# EAGLE design potentiometer (EAGLE 7.2.0)
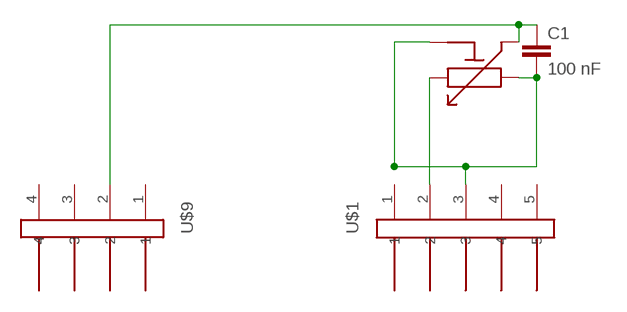
[diagram p0: schematic, sheet 1]

## Parts
C1  100 nF  C-EUC0805  [C0805]
U$1  JUMPER5M  [JUMPER5M]
U$2  POTENTIOMETER-RK09  [POTENTIOMETER-RK09]
U$9  JUMPER4M  [JUMPER4M]

## Nets
GND: C1.2 U$1.3 U$2.1 U$2.GND1(GND) U$2.GND2(GND)
N$1: C1.1 U$2.2 U$9.2
N$2: U$1.2 U$2.3
Unconnected: U$1.1 U$1.4 U$1.5 U$9.1 U$9.3 U$9.4

## Library data of the parts
C1 = resistor:C-EU: CAPACITOR, European symbol
U$1 = !stavebnice03:JUMPER5M
U$2 = !stavebnice03:POTENTIOMETER-RK09
U$9 = !stavebnice03:JUMPER4M

## Board
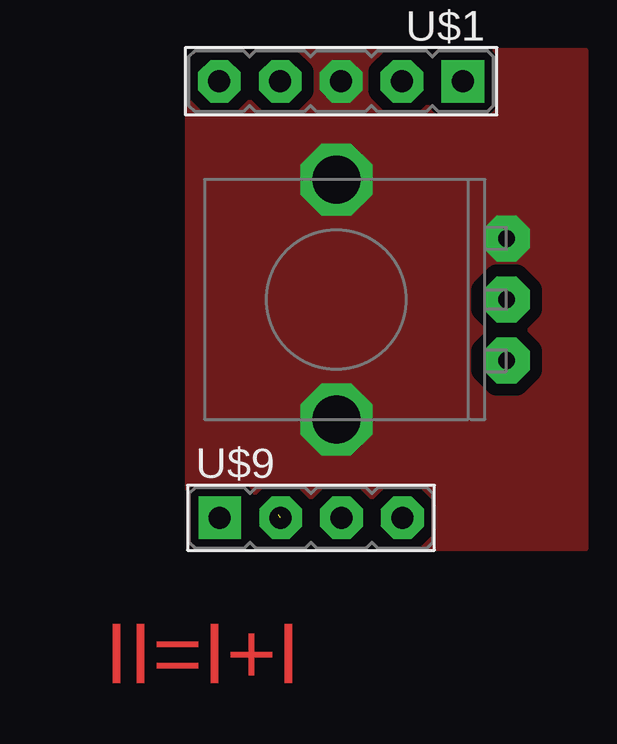
[diagram p1: board, top side]
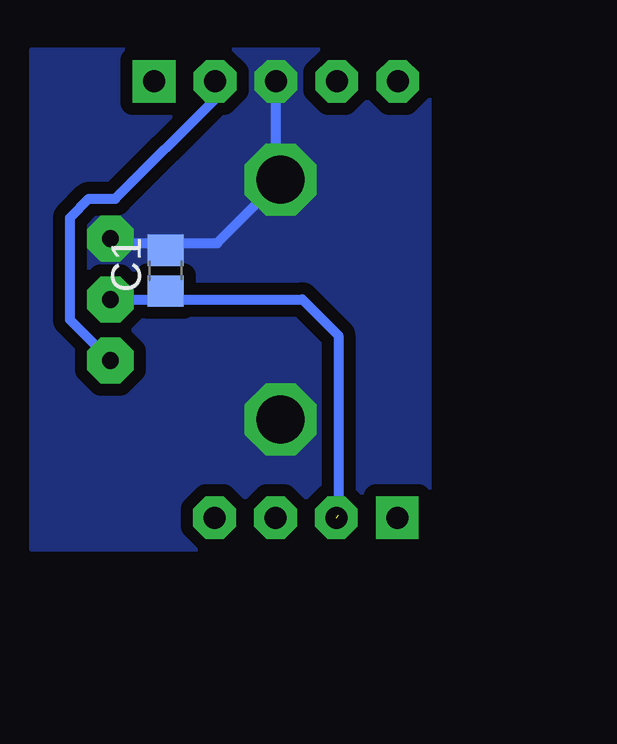
[diagram p2: board, bottom side, seen from below]

No outline drawn. Coordinates in mm, seen from the top.
Copper layers (1*16): Top 0.035mm / dielectric 1.5mm / Bottom 0.035mm
Design rules "default": minimum track width 10mil, minimum drill 24mil, track to track 8mil, track to pad 8mil, pad to pad 8mil, via to via 8mil, smd to smd 8mil, copper to edge 40mil, drill to drill 8mil, minimum pad ring 10mil, minimum via ring 8mil, stop-mask expansion 4mil, vias tented up to drill 0mil, thermal gap 10mil

### Footprints (pad centres in the part's own frame; a part is rotated, then mirrored left to right if it is on the bottom)
C0805 = smd 1.3 x 1.5: 1 -0.85,0; 2 0.85,0
JUMPER5M = drill 0.914 pad 1.778 square: 1 -5.08,0 | drill 0.914 pad 1.778 octagon: 2 -2.54,0; 3 0,0; 4 2.54,0; 5 5.08,0
POTENTIOMETER-RK09 = drill 0.7 pad 1.93 octagon: 1 -2.54,7.1; 2 0,7.1; 3 2.54,7.1 | drill 2 octagon: GND1 -5,0; GND2 5,0
JUMPER4M = drill 0.914 pad 1.778 square: 1 -3.81,0 | drill 0.914 pad 1.778 octagon: 2 -1.27,0; 3 1.27,0; 4 3.81,0

### Placement (x,y rotation side)
C1  15.3,11.7 90 bottom
U$1  10.7,19.6 180 top
U$2  10.5,10.5 270 top
U$9  9.45,1.4 0 top

### Tracks (layer width: path | path; a pad name or v marks a point on that pad's centre or on a via)
GND
  Bottom 0.406: U$1.3 10.7,15.5 U$2.GND1 13.15,12.85 15.4,12.85 | U$2.1 17.41,12.85 15.4,12.85 | C1.2 15.3,12.75 15.4,12.85
  pour Bottom (isolate 0.508, rank 2, no thermals): 4.3,0.1 4.3,20.9 20.9,20.9 20.9,0.1
  pour Top (isolate 0.508, rank 2, no thermals): 4.3,0.1 4.3,20.9 20.9,20.9 20.9,0.1
N$1  (1 unrouted)
  Bottom 0.406: 8.1,1.52 8.1,9 9.6,10.5 15.4,10.5 | U$2.2 15.4,10.5 | C1.1 15.3,10.6 15.4,10.5
N$2
  Bottom 0.406: U$2.3 19.3,9.66 19.3,13.9 18.5,14.7 17.4,14.7 13.2,18.9 13.2,19.56 U$1.2

### Text on the board
Top: II=I+I
centerDrill: potentiometer